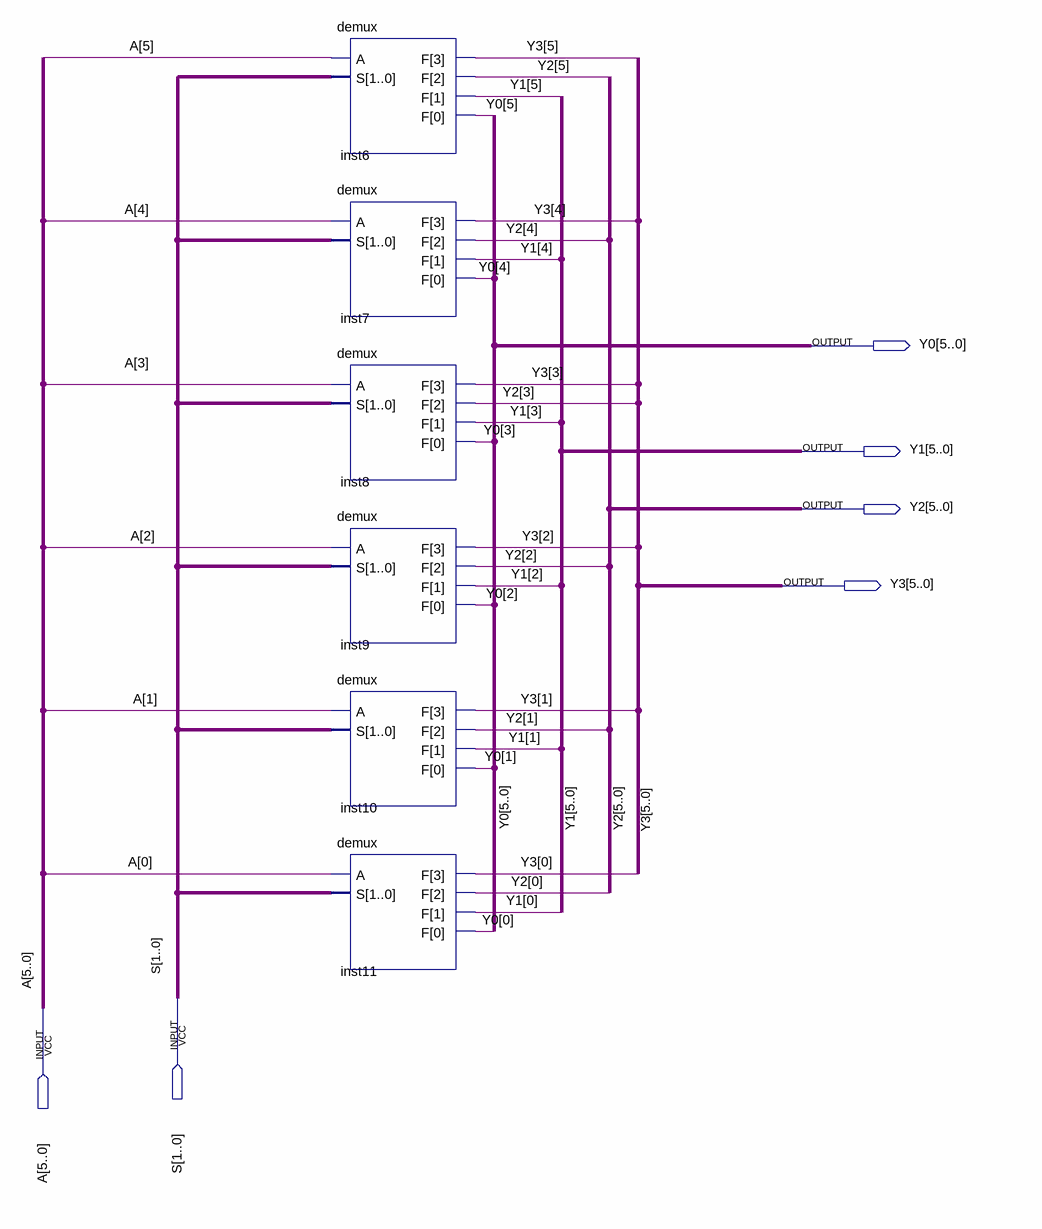
[diagram p0: schematic sheet]
// Quartus schematic demux_final.bdf as structural Verilog: 6 symbols, 6 pins
module demux_final (
  input  [1:0] S,
  input  [5:0] A,
  output [5:0] Y0,
  output [5:0] Y1,
  output [5:0] Y2,
  output [5:0] Y3
);

  demux inst6 (.A(A[5]), .S(S), .F({Y3[5], Y2[5], Y1[5], Y0[5]}));
  demux inst7 (.A(A[4]), .S(S), .F({Y3[4], Y2[4], Y1[4], Y0[4]}));
  demux inst8 (.A(A[3]), .S(S), .F({Y3[3], Y2[3], Y1[3], Y0[3]}));
  demux inst9 (.A(A[2]), .S(S), .F({Y3[2], Y2[2], Y1[2], Y0[2]}));
  demux inst10 (.A(A[1]), .S(S), .F({Y3[1], Y2[1], Y1[1], Y0[1]}));
  demux inst11 (.A(A[0]), .S(S), .F({Y3[0], Y2[0], Y1[0], Y0[0]}));
endmodule
